# EAGLE design Geiger_v3 (EAGLE 9.6.2)
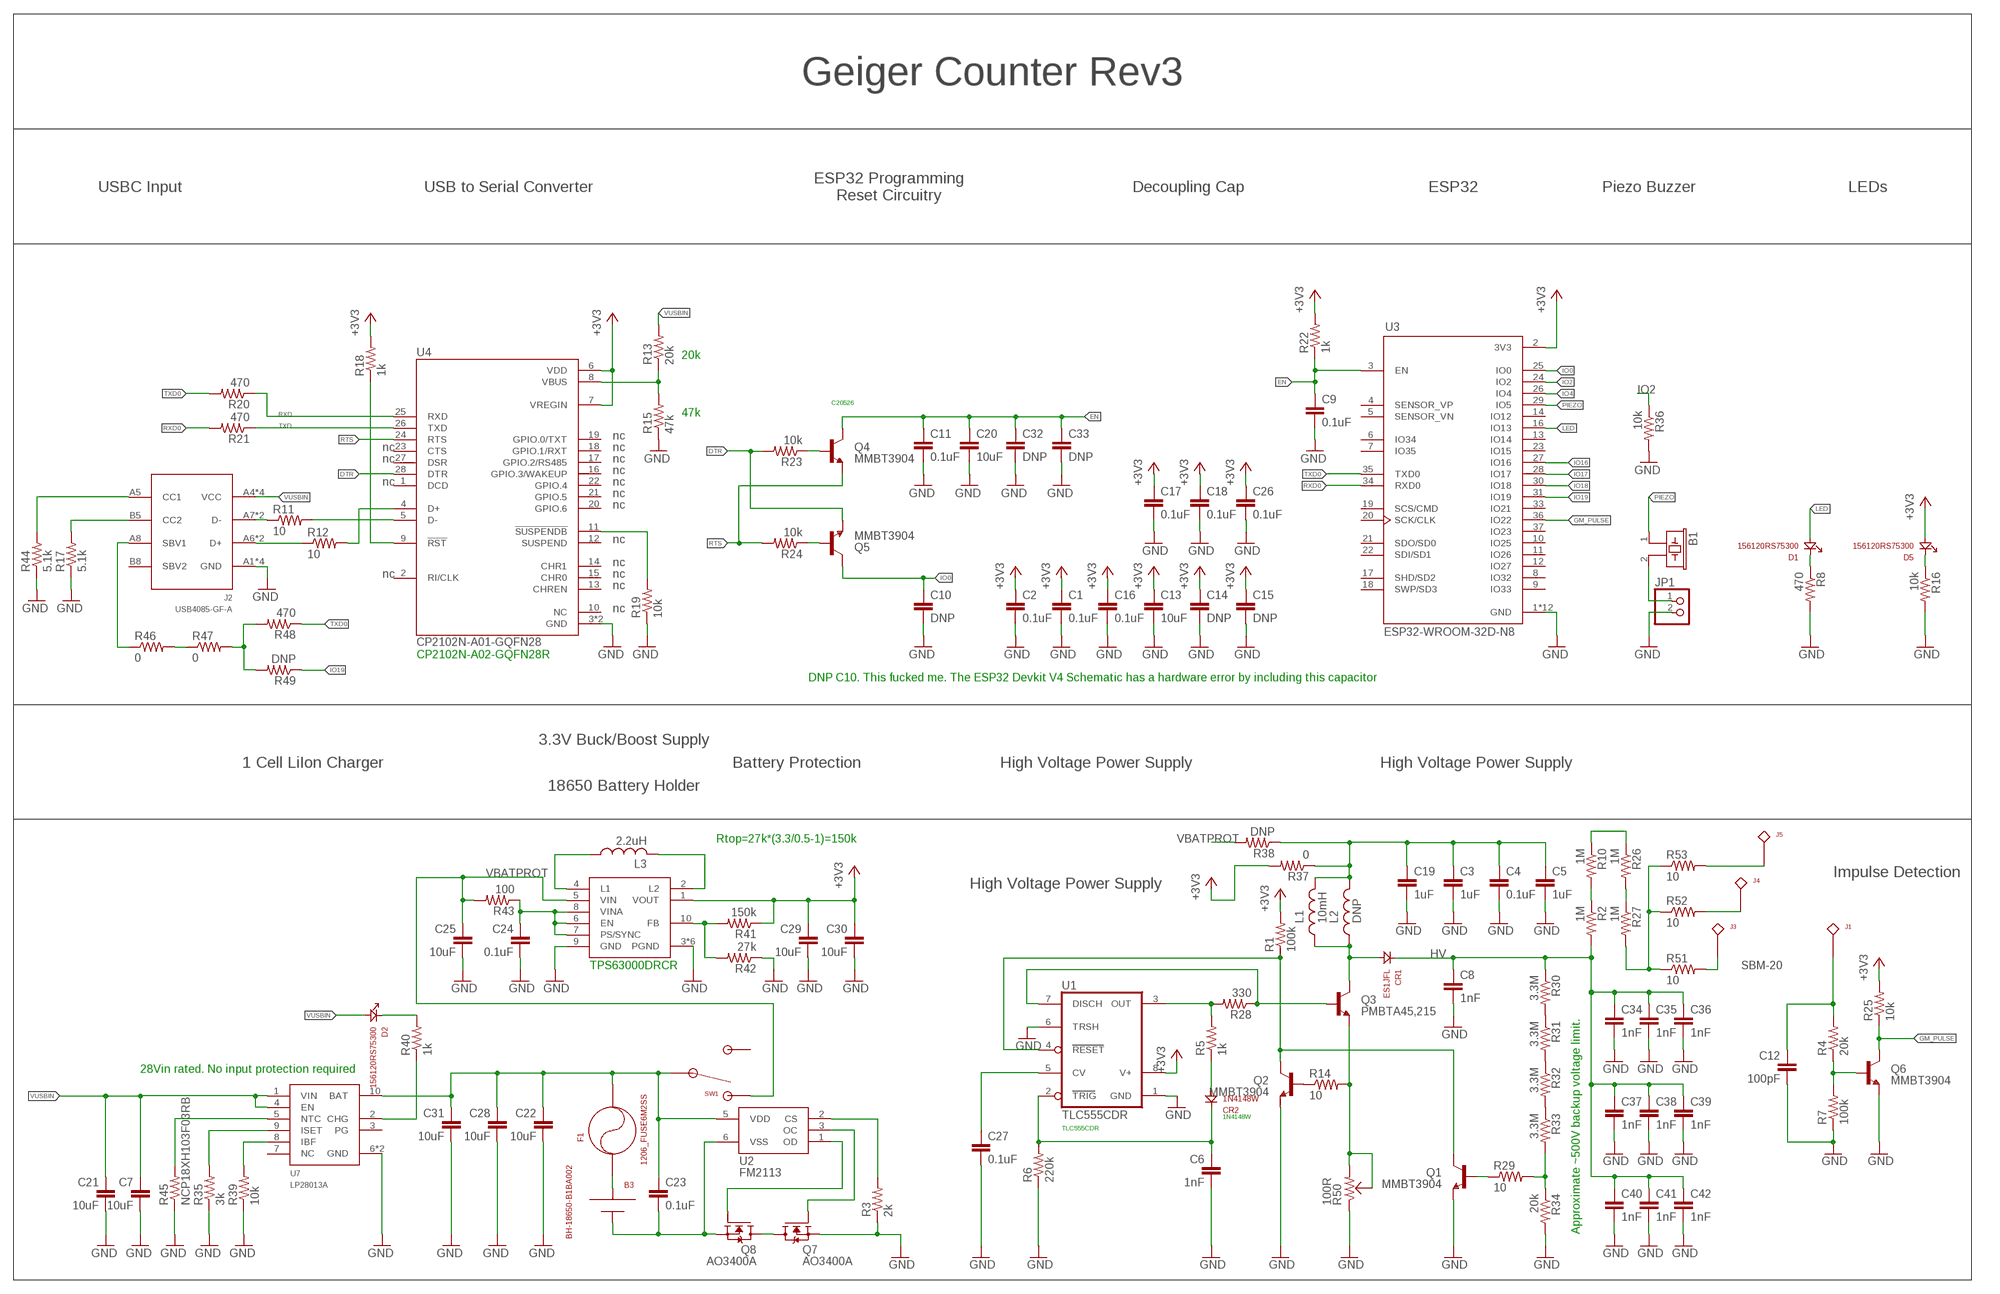
[diagram p0: schematic, sheet 1]

## Parts
B1  PIEZO17MM  [PS1740P02E]
B3  BH-18650-B1BA002  [18650]
C1  0.1uF  0603_CAPACITOR  [0603]
C2  0.1uF  0603_CAPACITOR  [0603]
C3  1uF  0603_CAPACITOR  [0603]
C4  0.1uF  0603_CAPACITOR  [0603]
C5  1uF  0603_CAPACITOR  [0603]
C6  1nF  0603_CAPACITOR  [0603]
C7  10uF  0603_CAPACITOR  [0603]
C8  1nF  1206_CAPACITOR  [1206]
C9  0.1uF  0603_CAPACITOR  [0603]
C10  DNP  0603_CAPACITOR  [0603]
C11  0.1uF  0603_CAPACITOR  [0603]
C12  100pF  0603_CAPACITOR  [0603]
C13  10uF  0603_CAPACITOR  [0603]
C14  DNP  0603_CAPACITOR  [0603]
C15  DNP  0603_CAPACITOR  [0603]
C16  0.1uF  0603_CAPACITOR  [0603]
C17  0.1uF  0603_CAPACITOR  [0603]
C18  0.1uF  0603_CAPACITOR  [0603]
C19  1uF  0603_CAPACITOR  [0603]
C20  10uF  0603_CAPACITOR  [0603]
C21  10uF  0603_CAPACITOR  [0603]
C22  10uF  0603_CAPACITOR  [0603]
C23  0.1uF  0603_CAPACITOR  [0603]
C24  0.1uF  0603_CAPACITOR  [0603]
C25  10uF  0603_CAPACITOR  [0603]
C26  0.1uF  0603_CAPACITOR  [0603]
C27  0.1uF  0603_CAPACITOR  [0603]
C28  10uF  0603_CAPACITOR  [0603]
C29  10uF  0603_CAPACITOR  [0603]
C30  10uF  0603_CAPACITOR  [0603]
C31  10uF  0603_CAPACITOR  [0603]
C32  DNP  0603_CAPACITOR  [0603]
C33  DNP  0603_CAPACITOR  [0603]
C34  1nF  1206_CAPACITOR  [1206]
C35  1nF  1206_CAPACITOR  [1206]
C36  1nF  1206_CAPACITOR  [1206]
C37  1nF  1206_CAPACITOR  [1206]
C38  1nF  1206_CAPACITOR  [1206]
C39  1nF  1206_CAPACITOR  [1206]
C40  1nF  1206_CAPACITOR  [1206]
C41  1nF  1206_CAPACITOR  [1206]
C42  1nF  1206_CAPACITOR  [1206]
CR1  ES1JFL  [SOD123(AK)]
CR2  1N4148W  BAS21GWX  [SOD123]
D1  156120RS75300  [1206_REV]
D2  156120RS75300  [1206_REV]
D5  156120RS75300  [1206_REV]
F1  1206_FUSE6M2SS  [1206_FUSE_6M2_SS]
J1  01010002Z  [01010002Z]
J2  USB4085-GF-A  [USBC]
J3  01010002Z  [01010002Z]
J4  01010002Z  [01010002Z]
J5  01010002Z  [01010002Z]
JP1  PINHD-1X2  [1X02]
L1  10mH  FNR8065S103MT  [FNR8065S]
L2  DNP  SDR1005-103KL  [SDR1005]
L3  2.2uH  CY43-2.2UH  [CY43]
Q1  MMBT3904  MMBT3904-TPCENTERED  [SOT23-3_CENTERED]
Q2  MMBT3904  MMBT3904-TPCENTERED  [SOT23-3_CENTERED]
Q3  PMBTA45,215  [SOT23-3]
Q4  MMBT3904  MMBT3904-TPCENTERED  [SOT23-3_CENTERED]
Q5  MMBT3904  MMBT3904-TPCENTERED  [SOT23-3_CENTERED]
Q6  MMBT3904  MMBT3904-TPCENTERED  [SOT23-3_CENTERED]
Q7  AO3400A  [SOT23-3_CENTERED]
Q8  AO3400A  [SOT23-3_CENTERED]
R1  100k  0603_RESISTOR  [0603]
R2  1M  0603_RESISTOR  [0603]
R3  2k  0603_RESISTOR  [0603]
R4  20k  0603_RESISTOR  [0603]
R5  1k  0603_RESISTOR  [0603]
R6  220k  0603_RESISTOR  [0603]
R7  100k  0603_RESISTOR  [0603]
R8  470  0603_RESISTOR  [0603]
R10  1M  0603_RESISTOR  [0603]
R11  10  0603_RESISTOR  [0603]
R12  10  0603_RESISTOR  [0603]
R13  20k  0603_RESISTOR  [0603]
R14  10  0603_RESISTOR  [0603]
R15  47k  0603_RESISTOR  [0603]
R16  10k  0603_RESISTOR  [0603]
R17  5.1k  0603_RESISTOR  [0603]
R18  1k  0603_RESISTOR  [0603]
R19  10k  0603_RESISTOR  [0603]
R20  470  0603_RESISTOR  [0603]
R21  470  0603_RESISTOR  [0603]
R22  1k  0603_RESISTOR  [0603]
R23  10k  0603_RESISTOR  [0603]
R24  10k  0603_RESISTOR  [0603]
R25  10k  0603_RESISTOR  [0603]
R26  1M  0603_RESISTOR  [0603]
R27  1M  0603_RESISTOR  [0603]
R28  330  0603_RESISTOR  [0603]
R29  10  0603_RESISTOR  [0603]
R30  3.3M  0603_RESISTOR  [0603]
R31  3.3M  0603_RESISTOR  [0603]
R32  3.3M  0603_RESISTOR  [0603]
R33  3.3M  0603_RESISTOR  [0603]
R34  20k  0603_RESISTOR  [0603]
R35  3k  0603_RESISTOR  [0603]
R36  10k  0603_RESISTOR  [0603]
R37  0  0603_RESISTOR  [0603]
R38  DNP  0603_RESISTOR  [0603]
R39  10k  0603_RESISTOR  [0603]
R40  1k  0603_RESISTOR  [0603]
R41  150k  0603_RESISTOR  [0603]
R42  27k  0603_RESISTOR  [0603]
R43  100  0603_RESISTOR  [0603]
R44  5.1k  0603_RESISTOR  [0603]
R45  NCP18XH103F03RB  0603_RESISTOR  [0603]
R46  0  1206_RESISTOR  [1206]
R47  0  1206_RESISTOR  [1206]
R48  470  0603_RESISTOR  [0603]
R49  DNP  0603_RESISTOR  [0603]
R50  100R  ST-4ETB101  [ST-4]
R51  10  0603_RESISTOR  [0603]
R52  10  0603_RESISTOR  [0603]
R53  10  0603_RESISTOR  [0603]
SW1  SPDT  100SP1T2B4M6QE  [TOGGLE_RA]
U1  TLC555CDR  TLC555CDG4  [SOIC8]
U2  FM2113  [SOT23-6]
U3  ESP32-WROOM-32D-N8  ESP32-WROOM-32D  [MODULE_ESP32-WROOM-32D]
U4  CP2102N-A01-GQFN28  [QFN50P500X500X80-29N]
U6  TPS63000DRCR  [S-PVSON-N10]
U7  LP28013A  [10DFN]

## Nets
+3V3: C1.1 C2.1 C13.1 C14.1 C15.1 C16.1 C17.1 C18.1 C26.1 C29.1 C30.1 D5.A R1.2 R18.2 R22.2 R25.2 R37.2 R41.1 U1.8(V+) U3.2(3V3) U4.6(VDD) U4.7(VREGIN) U6.1(VOUT)
DTR: Q5.2(E) R23.2 U4.28(DTR)
EN: C9.1 C11.1 C20.1 C32.1 C33.1 Q4.3(C) R22.1 U3.3(EN)
GM_PULSE: Q6.3(C) R25.1 U3.36(IO22)
GND: C1.2 C2.2 C3.2 C4.2 C5.2 C6.2 C7.2 C8.2 C9.2 C10.2 C11.2 C12.2 C13.2 C14.2 C15.2 C16.2 C17.2 C18.2 C19.2 C20.2 C21.2 C22.2 C24.2 C25.2 C26.2 C27.2 C28.2 C29.2 C30.2 C31.2 C32.2 C33.2 C34.2 C35.2 C36.2 C37.2 C38.2 C39.2 C40.2 C41.2 C42.2 J2.A1(GND) J2.A12(GND) J2.B1(GND) J2.B12(GND) JP1.2 Q1.2(E) Q2.2(E) Q6.2(E) Q7.2(S) R3.1 R6.1 R7.1 R8.2 R15.1 R16.2 R17.1 R19.1 R34.2 R35.1 R36.2 R39.1 R42.1 R44.1 R45.1 R50.3 U1.1(GND) U1.6(TRSH) U3.1(GND) U3.15(GND) U3.38(GND) U3.39_1(GND) U3.39_2(GND) U3.39_3(GND) U3.39_4(GND) U3.39_5(GND) U3.39_6(GND) U3.39_7(GND) U3.39_8(GND) U3.39_9(GND) U4.3(GND) U4.29(GND) U6.3(PGND) U6.9(GND) U6.PG1(PGND) U6.PG2(PGND) U6.PG3(PGND) U6.PG4(PGND) U6.PG(PGND) U7.6(GND) U7.GF(GND)
HV [HV]: C8.1 C34.1 C35.1 C36.1 C37.1 C38.1 C39.1 C40.1 C41.1 C42.1 CR1.K R2.2 R30.1
IO0: C10.1 Q5.3(C) U3.25(IO0)
IO2: R36.1 U3.24(IO2)
IO4: U3.26(IO4)
IO16: U3.27(IO16)
IO17: U3.28(IO17)
IO18: U3.30(IO18)
IO19: R49.1 U3.31(IO19)
LED: D1.A U3.16(IO13)
N$1: CR2.2(A) R5.1
N$2: J2.A7(D-) J2.B7(D-) R11.1
N$3: Q1.3(C) Q2.3(C) R1.1 U1.4(RESET)
N$4: J2.A6(D+) J2.B6(D+) R12.1
N$5: R11.2 U4.5(D-)
N$6: R12.2 U4.4(D+)
N$7: R13.1 R15.2 U4.8(VBUS)
N$8: Q3.1(B) R28.1 U1.7(DISCH)
N$9: C6.1 CR2.1(K) R6.2 U1.2(TRIG)
N$10: R5.2 R28.2 U1.3(OUT)
N$11: Q3.2(E) R14.2 R50.1 R50.2(ADJ)
N$12: B1.2 JP1.1
N$13: Q2.1(B) R14.1
N$14: Q6.1(B) R4.1 R7.2
N$15 [HV]: J4.P$1 R52.2
N$16 [HV]: R2.1 R10.2
N$17 [HV]: R10.1 R26.1
N$18: R18.1 U4.9(!RST)
N$19: D5.K R16.1
N$20: R19.2 U4.11(!SUSPENDB)
N$21 [HV]: R26.2 R27.1
N$22: Q4.1(B) R23.1
N$23: R39.2 U7.8(IBF)
N$24: Q5.1(B) R24.1
N$25: J2.B5(CC2) R17.2
N$26: Q1.1(B) R29.1
N$27: D1.K R8.1
N$28 [HV]: R31.2 R32.1
N$29: R29.2 R33.2 R34.1
N$30 [HV]: R30.2 R31.1
N$31 [HV]: R32.2 R33.1
N$32: J2.A5(CC1) R44.2
N$33: C27.1 U1.5(CV)
N$34: R40.1 U7.2(CHG)
N$35: C3.1 C4.1 C5.1 C19.1 L1.P$2 L2.P$2 R37.1 R38.1
N$36: R35.2 U7.9(ISET)
N$37: D2.K R40.2
N$38: R45.2 U7.5(NTC)
N$39: C12.1 J1.P$1 R4.2
N$40: B3.- C23.2 Q8.2(S) U2.6(VSS)
N$41: C22.1 C23.1 C28.1 C31.1 F1.P$2 SW1.2(COM) U2.5(VDD) U7.10(BAT)
N$42: Q8.1(G) U2.1(OD)
N$43: Q7.3(D) Q8.3(D)
N$44: L3.P$1 U6.4(L1)
N$45: Q7.1(G) U2.3(OC)
N$46: R3.2 U2.2(CS)
N$47: L3.P$2 U6.2(L2)
N$48: R41.2 R42.2 U6.10(FB)
N$49: C24.1 R43.1 U6.6(EN) U6.7(PS/SYNC) U6.8(VINA)
N$50: J2.A8(SBV1) R46.1
N$51: R46.2 R47.1
N$52: R47.2 R48.2 R49.2
N$53 [HV]: J5.P$1 R53.2
N$54 [HV]: R27.2 R51.1 R52.1 R53.1
N$55 [HV]: J3.P$1 R51.2
PIEZO: B1.1 U3.29(IO5)
RAWBATT [HV]: B3.+ F1.P$1
RTS: Q4.2(E) R24.2 U4.24(RTS)
RXD: R20.1 U4.25(RXD)
RXD0: R21.2 U3.34(RXD0)
SW [HV]: CR1.A L1.P$1 L2.P$1 Q3.3(C)
TXD: R21.1 U4.26(TXD)
TXD0: R20.2 R48.1 U3.35(TXD0)
VBATPROT: C25.1 R38.2 R43.2 SW1.3 U6.5(VIN)
VUSBIN: C7.1 C21.1 D2.A J2.A4(VCC) J2.A9(VCC) J2.B4(VCC) J2.B9(VCC) R13.2 U7.1(VIN) U7.4(EN)
Unconnected: J2.B8(SBV2) SW1.1 U3.4(SENSOR_VP) U3.5(SENSOR_VN) U3.6(IO34) U3.7(IO35) U3.8(IO32) U3.9(IO33) U3.10(IO25) U3.11(IO26) U3.12(IO27) U3.13(IO14) U3.14(IO12) U3.17(SHD/SD2) U3.18(SWP/SD3) U3.19(SCS/CMD) U3.20(SCK/CLK) U3.21(SDO/SD0) U3.22(SDI/SD1) U3.23(IO15) U3.33(IO21) U3.37(IO23) U4.1(DCD) U4.2(RI/CLK) U4.10(NC) U4.12(SUSPEND) U4.13(CHREN) U4.14(CHR1) U4.15(CHR0) U4.16(GPIO.3/WAKEUP) U4.17(GPIO.2/RS485) U4.18(GPIO.1/RXT) U4.19(GPIO.0/TXT) U4.20(GPIO.6) U4.21(GPIO.5) U4.22(GPIO.4) U4.23(CTS) U4.27(DSR) U7.3(PG) U7.7(NC)

## Notes on the sheet
- Geiger Counter Rev3
- USBC Input | USB to Serial Converter
- ESP32 Programming
  Reset Circuitry
- Decoupling Cap | ESP32 | Piezo Buzzer | LEDs
- 20k
- C20526
- 47k
- nc
- nc | nc
- nc | nc
- nc
- nc | nc
- nc
- nc
- nc
- nc
- nc | nc
- nc
- nc
- CP2102N-A02-GQFN28R
- DNP C10. This fucked me. The ESP32 Devkit V4 Schematic has a hardware error by including this capacitor
- 3.3V Buck/Boost Supply
- 1 Cell LiIon Charger | Battery Protection | High Voltage Power Supply | High Voltage Power Supply
- 18650 Battery Holder
- Rtop=27k*(3.3/0.5-1)=150k
- Impulse Detection
- High Voltage Power Supply
- TPS63000DRCR | SBM-20
- 28Vin rated. No input protection required
- 1N4148W
- TLC555CDR
- Approximate ~500V backup voltage limit.

## Library data of the parts
B1 = mightyohm:PIEZO; OC_FARNELL: unknown; OC_NEWARK: unknown
B3 = ruark2:BH-18650-B1BA002: 18650 JLCPCB C2988620
C1-C7 C9-C33 = ruark2:0603_CAPACITOR: 0603 Capacitor -- WARNING: NO DEFINED VALUE OR PART NUMBER; VALUE: sel
C8 C34-C42 = ruark2a:1206_CAPACITOR: NO DEFINED PN; VALUE: sel
CR1 = ruark2:ES1JFL: Diode Standard 600 V 1A Surface Mount SOD-123F; PARTNO: ES1JFLCT-ND
CR2 = ruark2:BAS21GWX: Diode Standard 200V 225mA (DC) Surface Mount SOD-123; PARTNO: 1727-7323-1-ND
D1 D2 D5 = ruark2:156120RS75300: Red 624nm LED Indication - Discrete 2V 1206 Reverse Mount (3216 Metric); PARTNO: 732-5031-1-ND
F1 = ruark2:1206_FUSE
J1 J3-J5 = ruark2:01010002Z: SMD Fuse Clip 15 A 250V 1 Circuit Cartridge Chassis Mount; PARTNO: F4080-ND
J2 = ruark2a:USB4085-GF-A: USB - C USB 2.0 Receptacle Connector 16 Position Through Hole, Right Angle; PARTNO: 2073-USB4085-GF-ACT-ND
JP1 = pinhead:PINHD-1X2: PIN HEADER
L1 = ruark2:FNR8065S103MT: 130mA 10mH ±20% 22.8Ω SMD Power Inductors ROHS
L2 = ruark2:SDR1005-103KL: 10 mH Unshielded Wirewound Inductor 100 mA 39Ohm Max Nonstandard 100mA; PARTNO: SDR1005-103KLCT-ND; VALUE: 10mH
L3 = ruark2a:CY43-2.2UH: 2.3A 2.2uH ±20% 42mΩ SMD,4x4.5mm Inductors (SMD) ROHS; JLCPCB: C2929416
Q1 Q2 Q4-Q6 = ruark2a:MMBT3904-TP: Bipolar (BJT) Transistor NPN 40V 200mA 300MHz 350mW Surface Mount SOT-23 (SMD 2N3904)
Q3 = ruark2:PMBTA45,215: Bipolar (BJT) Transistor NPN 500 V 150 mA 35MHz 300 mW Surface Mount TO-236AB; PARTNO: 1727-5332-1-ND
Q7 Q8 = ruark2a:AO3400A: N-Channel 5.7A (Ta) 1.4W (Ta) Surface Mount SOT-23-3L
R1-R8 R10-R45 R48 R49 R51-R53 = ruark2:0603_RESISTOR: 0603 Resistor -- WARNING: NO DEFINED PART NUMBER OR VALUE; VALUE: sel
R46 R47 = ruark2a:1206_RESISTOR: NO DEFINED PN; VALUE: sel
R50 = ruark2:ST-4ETB101: ±20% ±100ppm/℃ 250mW 100Ω SMD Variable Resistors/Potentiometers ROHS; JLCPCB: C2922093
SW1 = ruark2:100SP1T2B4M6QE: Toggle Switch SPDT Through Hole, Right Angle 5A 120V; PARTNO: EG2362-ND
U1 = ruark2:TLC555CDG4: 555 Type, Timer/Oscillator (Single) IC 2.1MHz 8-SOIC; PARTNO: 296-52992-ND
U2 = ruark2a:FM2113: SOT-23-6 Battery Protection UVLO, OV, OC
U3 = ESP32-WROOM-32D:ESP32-WROOM-32D: Bluetooth, WiFi 802.11b/g/n, Bluetooth v4.2 + EDR, Class 1, 2 and 3 Transceiver Module 2.4GHz ~ 2.5GHz Integrated, Trace Surface Mount Check prices <https://pricing.snapeda.com/parts/ESP32-WROOM-32D/Espressif%20Systems/view-part?ref=eda>; AVAILABILITY: Bad; DESCRIPTION: Bluetooth, WiFi 802.11b/g/n, Bluetooth v4.2 +EDR, Class 1, 2 and 3 Transceiver Module 2.4GHz ~ 2.5GHz Integrated, Trace Surface Mount; MF: Espressif Systems; MP: ESP32-WROOM-32D; PACKAGE: Module Espressif Systems; PRICE: None
U4 = CP2102N-A01-GQFN28:CP2102N-A01-GQFN28: USB Bridge, USB to UART USB 2.0 UART Interface 28-QFN (5x5) Check availability <https://pricing.snapeda.com/parts/CP2102N-A01-GQFN28/Silicon%20Labs/view-part?ref=eda>; AVAILABILITY: In Stock; DESCRIPTION: USB Bridge, USB to UART USB 2.0 UART Interface 28-QFN (5x5); MF: Silicon Labs; MP: CP2102N-A01-GQFN28; PACKAGE: WFQFN-28 Silicon Labs; PRICE: None
U6 = ruark2a:TPS63000DRCR: Buck-Boost Switching Regulator IC Positive Adjustable 1.2V 1 Output 1.6A (Switch) 10-VFDFN Exposed Pad; PARTNO: 296-19641-1-ND
U7 = ruark2:LP28013A: TDFN-10 Battery Management ICs ROHS JLCPCB: C517139

## Net classes
1 HV: clearance 1.27 mm

## Board
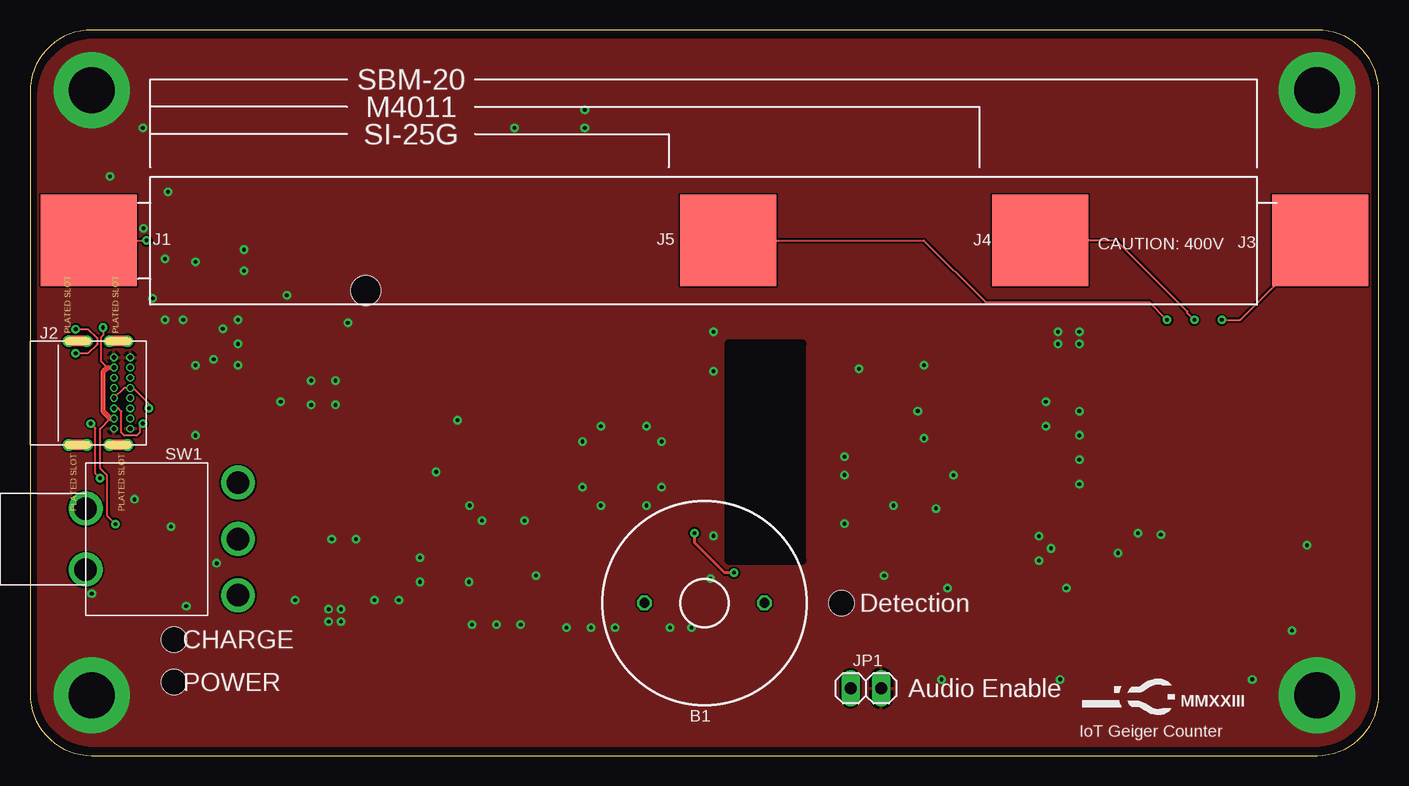
[diagram p1: board, top side]
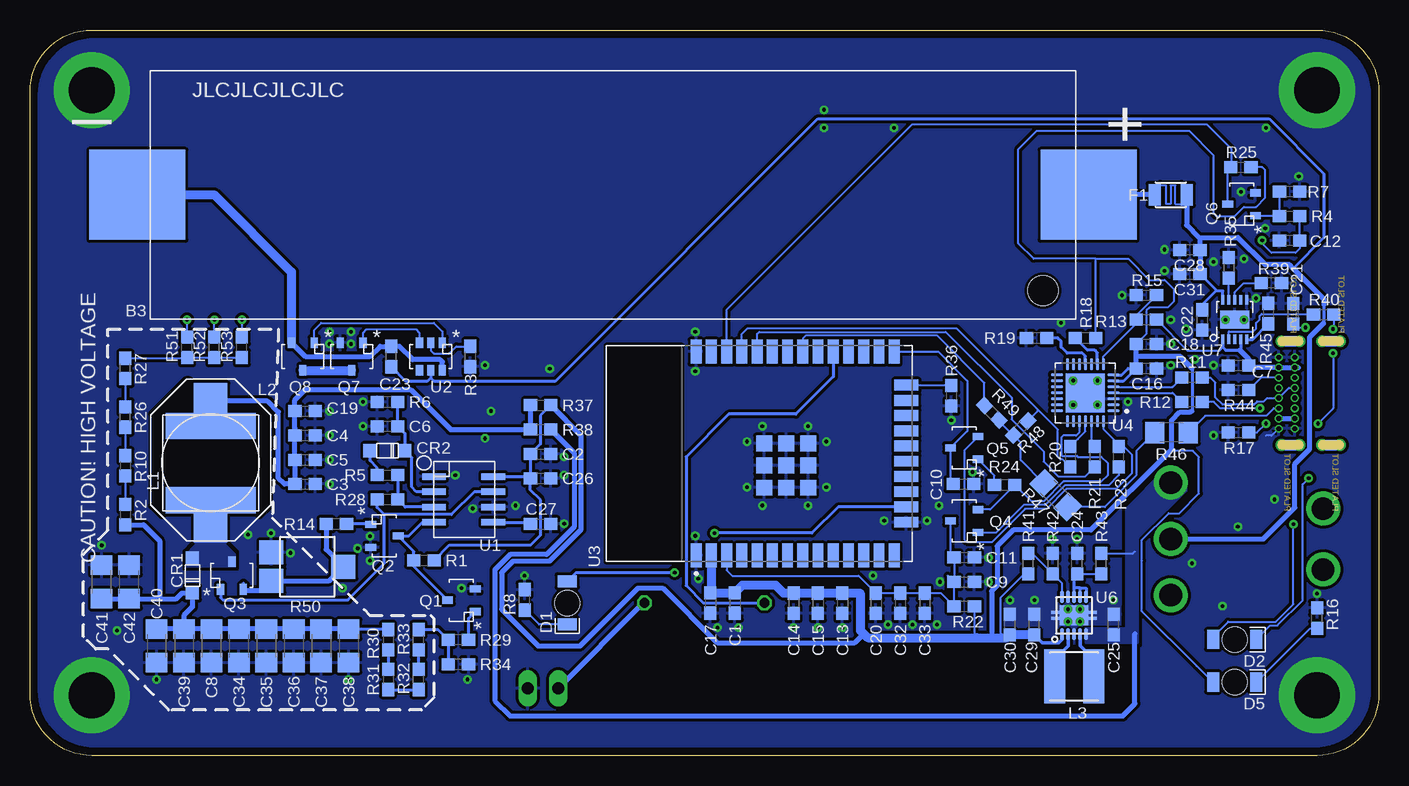
[diagram p2: board, bottom side, seen from below]

Size 112.4 x 60.5 mm. Coordinates in mm from the lower left corner, seen from the top.
Outline: 0,55.35 0,5.15 arc90 5.15,0 107.25,0 arc90 112.4,5.15 112.4,55.35 arc90 107.25,60.5 5.15,60.5 arc90 0,55.35
Copper layers (1*16): Top 0.035mm / dielectric 1.5mm / Bottom 0.035mm
Design rules "default *": minimum track width 6mil, minimum drill 12mil, track to track 6mil, track to pad 6mil, pad to pad 6mil, via to via 6mil, smd to smd 6mil, copper to edge 0mil, drill to drill 6mil, minimum pad ring 5mil, minimum via ring 8mil, stop-mask expansion 4mil, vias tented up to drill 12mil, thermal gap 10mil
tRestrict: area 58.2,16.3 to 64.3,34.3
bRestrict: area 92.5,20.1 to 102.2,31.3; area 22.9,4.3 to 27.9,8.7

### Footprints (pad centres in the part's own frame; a part is rotated, then mirrored left to right if it is on the bottom)
PS1740P02E = drill 0.813 octagon: 1 -5,0; 2 5,0
18650 = smd 8 x 7.5: + 39.63,0; - -39.63,0 | hole 2.5: 35.84,-8
0603 = smd 1.1 x 1: 1 -0.85,0; 2 0.85,0
1206 = smd 1.6 x 1.8: 1 -1.4,0; 2 1.4,0
SOD123(AK) = smd 1.1 x 1.1: A 1.45,0; K -1.45,0
SOD123 = smd 1.1 x 1.1: 1 -1.45,0; 2 1.45,0
1206_REV = smd 1 x 1.6: A -1.8,0; K 1.8,0 | hole 2.1: 0,0
1206_FUSE_6M2_SS = smd 1.016 x 1.778: P$1 -1.333,0; P$2 1.333,0
01010002Z = smd 8.001 x 7.62: P$1 0,0
USBC = drill 0.4 pad 0.65: A1 -2.975,0.98; A4 -2.125,0.98; A5 -1.275,0.98; A6 -0.425,0.98; A7 0.425,0.98; A8 1.275,0.98; A9 2.125,0.98; A12 2.975,0.98; B1 2.975,-0.37; B4 2.125,-0.37; B5 1.275,-0.37; B6 0.425,-0.37; B7 -0.425,-0.37; B8 -1.275,-0.37; B9 -2.125,-0.37; B12 -2.975,-0.37 | drill 0.65 pad 0.9: P$1 -4.325,0.75; P$2 4.325,0.75; P$3 4.325,-0.75; P$4 -4.325,-2.63; P$5 -4.325,-0.75; P$6 -4.325,-4.13; P$7 4.325,-2.63; P$8 4.325,-4.13
1X02 = drill 1.016 long: 1 -1.27,0; 2 1.27,0
FNR8065S = smd 2.2 x 7.5: P$1 -3.1,0; P$2 3.1,0
SDR1005 = smd 3 x 2.8: P$1 -5.15,0; P$2 5.15,0
CY43 = smd 1.75 x 4.5: P$1 1.625,0; P$2 -1.625,0
SOT23-3_CENTERED = smd 0.6 x 0.9: 1 -0.95,-1.15; 2 0.95,-1.15; 3 0,1.15
SOT23-3 = smd 0.6 x 0.9: 1 0.32,-1.15; 2 2.22,-1.15; 3 1.27,1.15
ST-4 = smd 2 x 2: 1 1.175,-3; 2 0,3; 3 -1.175,-3
TOGGLE_RA = drill 1.88: 1 4.699,12.7; 2 0,12.7; 3 -4.699,12.7; P$4 -2.54,0; P$5 2.54,0
SOIC8 = smd 1.981 x 0.533: 1 -2.477,1.905; 2 -2.477,0.635; 3 -2.477,-0.635; 4 -2.477,-1.905; 5 2.477,-1.905; 6 2.477,-0.635; 7 2.477,0.635; 8 2.477,1.905
SOT23-6 = smd 0.6 x 0.9: 1 -0.95,-1.15; 2 0,-1.15; 3 0.95,-1.15; 4 0.95,1.15; 5 0,1.15; 6 -0.95,1.15
MODULE_ESP32-WROOM-32D = smd 2 x 0.9: 1 -8.5,5.26; 2 -8.5,3.99; 3 -8.5,2.72; 4 -8.5,1.45; 5 -8.5,0.18; 6 -8.5,-1.09; 7 -8.5,-2.36; 8 -8.5,-3.63; 9 -8.5,-4.9; 10 -8.5,-6.17; 11 -8.5,-7.44; 12 -8.5,-8.71; 13 -8.5,-9.98; 14 -8.5,-11.25; 25 8.5,-11.25; 26 8.5,-9.98; 27 8.5,-8.71; 28 8.5,-7.44; 29 8.5,-6.17; 30 8.5,-4.9; 31 8.5,-3.63; 32 8.5,-2.36; 33 8.5,-1.09; 34 8.5,0.18; 35 8.5,1.45; 36 8.5,2.72; 37 8.5,3.99; 38 8.5,5.26 | smd 0.9 x 2: 15 -5.715,-12.25; 16 -4.445,-12.25; 17 -3.175,-12.25; 18 -1.905,-12.25; 19 -0.635,-12.25; 20 0.635,-12.25; 21 1.905,-12.25; 22 3.175,-12.25; 23 4.445,-12.25; 24 5.715,-12.25 | smd 1.33 x 1.33: 39_1 -2.835,-0.405; 39_2 -1,-0.405; 39_3 0.835,-0.405; 39_4 -2.835,-2.24; 39_5 -1,-2.24; 39_6 0.835,-2.24; 39_7 -2.835,-4.075; 39_8 -1,-4.075; 39_9 0.835,-4.075
QFN50P500X500X80-29N = smd 1.01 x 0.27: 1 -2.36,1.5; 2 -2.36,1; 3 -2.36,0.5; 4 -2.36,0; 5 -2.36,-0.5; 6 -2.36,-1; 7 -2.36,-1.5; 15 2.36,-1.5; 16 2.36,-1; 17 2.36,-0.5; 18 2.36,0; 19 2.36,0.5; 20 2.36,1; 21 2.36,1.5 | smd 0.27 x 1.01: 8 -1.5,-2.36; 9 -1,-2.36; 10 -0.5,-2.36; 11 0,-2.36; 12 0.5,-2.36; 13 1,-2.36; 14 1.5,-2.36; 22 1.5,2.36; 23 1,2.36; 24 0.5,2.36; 25 0,2.36; 26 -0.5,2.36; 27 -1,2.36; 28 -1.5,2.36 | smd 3.25 x 3.25: 29 0,0
S-PVSON-N10 = smd 0.28 x 1: 1 -1,-1.55; 2 -0.5,-1.55; 3 0,-1.55; 4 0.5,-1.55; 5 1,-1.55; 6 1,1.55; 7 0.5,1.55; 8 0,1.55; 9 -0.5,1.55; 10 -1,1.55 | smd 2.4 x 1.65: PG 0,0 | smd 0.7 x 0.28: PG1 -1.55,0.25; PG2 -1.55,-0.25; PG3 1.55,-0.25; PG4 1.55,0.25
10DFN = smd 0.8 x 0.24: 1 -1.65,1; 2 -1.65,0.5; 3 -1.65,0; 4 -1.65,-0.5; 5 -1.65,-1; 6 1.65,-1; 7 1.65,-0.5; 8 1.65,0; 9 1.65,0.5; 10 1.65,1 | smd 1.5 x 2.4: GF 0,0

### Placement (x,y rotation side)
B1  56.2,12.72 0 top
B3  63.82,46.76 0 bottom
C1  53.66,12.72 270 bottom
C2  69.85,25.15 0 bottom
C3  89.47,22.63 0 bottom
C4  89.47,26.69 0 bottom
C5  89.47,24.66 0 bottom
C6  82.62,27.46 180 bottom
C7  11.68,32.51 180 bottom
C8  97.28,9.14 270 bottom
C9  34.54,14.48 0 bottom
C10  34.61,22.63 0 bottom
C11  34.54,16.51 0 bottom
C12  7.43,42.95 180 bottom
C13  44.7,12.7 270 bottom
C14  48.77,12.7 270 bottom
C15  46.74,12.7 270 bottom
C16  19.37,32.28 0 bottom
C17  55.69,12.72 270 bottom
C18  19.37,34.31 0 bottom
C19  89.47,28.73 0 bottom
C20  41.91,12.7 270 bottom
C21  7.11,36.83 90 bottom
C22  14.73,36.32 270 bottom
C23  82.3,33.27 90 bottom
C24  25.15,16 90 bottom
C25  22.1,10.92 90 bottom
C26  69.85,23.11 0 bottom
C27  69.85,19.3 0 bottom
C28  15.75,42.16 180 bottom
C29  28.7,10.92 90 bottom
C30  30.73,10.92 90 bottom
C31  15.75,40.13 180 bottom
C32  39.88,12.7 270 bottom
C33  37.85,12.7 270 bottom
C34  95,9.14 270 bottom
C35  92.71,9.14 270 bottom
C36  90.42,9.14 270 bottom
C37  88.14,9.14 270 bottom
C38  85.85,9.14 270 bottom
C39  99.57,9.14 270 bottom
C40  101.85,9.14 270 bottom
C41  106.43,14.48 90 bottom
C42  104.14,14.48 90 bottom
CR1  98.87,15.01 90 bottom
CR2  82.62,25.42 180 bottom
D1  67.63,12.72 270 bottom
D2  12,9.68 0 bottom
D5  12,6.12 0 bottom
F1  17.34,46.76 0 bottom
J1  4.89,42.95 0 top
J2  7.37,30.23 270 top
J3  107.51,42.95 0 top
J4  84.2,42.95 180 top
J5  58.2,42.95 0 top
JP1  69.66,5.61 0 top
L1  97.35,24.38 90 bottom
L2  97.35,24.41 90 bottom
L3  25.4,6.6 0 bottom
Q1  76.45,12.95 90 bottom
Q2  82.86,18.31 270 bottom
Q3  96.84,15.01 0 bottom
Q4  34.54,19.56 90 bottom
Q5  34.54,25.65 90 bottom
Q6  11.43,45.97 90 bottom
Q7  85.6,33.27 180 bottom
Q8  89.66,33.27 180 bottom
R1  79.57,16.28 0 bottom
R2  104.46,20.09 270 bottom
R3  75.69,33.27 90 bottom
R4  7.43,44.98 0 bottom
R5  82.62,23.39 0 bottom
R6  82.62,29.49 0 bottom
R7  7.43,47.01 180 bottom
R8  71.19,12.98 90 bottom
R10  104.46,24.15 270 bottom
R11  15.56,31.52 180 bottom
R12  15.56,29.49 180 bottom
R13  19.37,36.35 0 bottom
R14  86.87,19.3 180 bottom
R15  19.37,38.38 0 bottom
R16  5.15,11.45 90 bottom
R17  11.68,26.92 0 bottom
R18  24.45,34.82 0 bottom
R19  28.51,34.82 0 bottom
R20  25.72,24.92 270 bottom
R21  23.69,24.92 270 bottom
R22  34.54,12.45 0 bottom
R23  21.66,24.92 90 bottom
R24  31.18,22.58 0 bottom
R25  11.5,49.05 0 bottom
R26  104.46,28.22 90 bottom
R27  104.46,32.28 90 bottom
R28  82.62,21.36 0 bottom
R29  76.71,9.65 180 bottom
R30  82.55,9.65 270 bottom
R31  82.55,6.35 270 bottom
R32  80.01,6.35 90 bottom
R33  80.01,9.65 90 bottom
R34  76.71,7.62 0 bottom
R35  12.51,40.66 270 bottom
R36  35.63,30 270 bottom
R37  69.85,29.21 0 bottom
R38  69.85,27.18 0 bottom
R39  8.96,39.39 180 bottom
R40  4.6,36.76 0 bottom
R41  29.21,16 90 bottom
R42  27.18,16 270 bottom
R43  23.11,16 90 bottom
R44  11.68,30.48 0 bottom
R45  9.21,36.85 270 bottom
R46  17.27,26.92 180 bottom
R47  26.92,21.72 135 bottom
R48  29.84,27.3 225 bottom
R49  32.26,28.57 315 bottom
R50  89.28,15.75 270 bottom
R51  99.31,34.04 90 bottom
R52  97.03,34.04 90 bottom
R53  94.74,34.04 90 bottom
SW1  4.64,18.06 270 top
U1  76.27,21.36 0 bottom
U2  78.99,33.27 180 bottom
U3  51.63,25.17 90 bottom
U4  24.45,30.25 180 bottom
U6  25.4,11.68 0 bottom
U7  12,36.35 90 bottom

### Tracks (layer width: path | path; a pad name or v marks a point on that pad's centre or on a via)
+3V3
  Bottom 0.152: R25.2 9.72,49.05 9.46,48.79 9.46,46.51 10.23,45.74 11.24,45.74 12,44.98 13.53,44.98 13.78,45.24 13.78,50.06 15.81,52.09 28.51,52.09 30.04,50.57 30.04,42.7 28.77,41.43 23.6,41.43 | R18.2 23.6,41.43 | 23.6,41.43 20.89,41.43 19.12,39.65 17.85,39.65 17.08,38.89 17.08,37.87 17.59,37.36 19.11,37.36 19.37,37.1 19.37,35.16 C18.1 | R22.2 33.69,9.98 33.53,9.82 | 31.5,9.82 31.5,13.21 29.55,15.15 R41.1 | D5.A 15.15,7.47 15.18,7.47 19.75,12.04 19.75,16.26 19.74,16.27 19.74,17.98 17.51,20.2 16.63,20.2 14.99,21.84 14.99,24.89 15.49,25.4 17.39,25.4 17.46,25.33
  Bottom 0.254: U4.6 21.25,31.25 C16.1 20.89,32.28 21.43,31.75 U4.7 | U1.8 70.85,23.27 C26.1 | C26.1 C2.1 69.87,25.98 69.87,28.34 R37.2 | R1.2 77.45,17.55 70.68,17.55 69.85,18.38 69.85,21.29 70.7,22.14 C26.1 | 15.56,32.28 15.56,28.73
  Bottom 0.279: U6.1 26.4,9.67 26.67,9.4 28.03,9.4 C29.1
  Bottom 0.406: C16.1 20.22,33.3 | 20.22,33.3 C18.1 | 20.22,33.3 16.58,33.3 15.56,32.28 | 15.56,28.73 15.62,28.73 15.71,28.63 16.58,28.63 17.27,27.94 17.27,25.52 17.46,25.33 23.99,18.8 30.48,18.8 31.8,17.48 31.8,14.18 32.26,13.73 32.26,9.82 | R37.2 66.5,26.71 66.5,18.82 69.11,16.2 72.16,16.2 73.1,15.26 73.1,12.19 70.05,9.14 66.55,9.14 61.72,13.97 59.69,13.97 55.12,9.4 43.69,9.4 42.93,10.16
  Bottom 0.762: U3.2 55.62,13.65 C17.1 C1.1 53.01,14.22 50.29,14.22 49.62,13.55 C14.1 C15.1 C13.1 43.27,13.55 43.18,13.46 43.18,10.41 42.93,10.16 42.58,9.82 33.53,9.82 32.26,9.82 31.5,9.82 30.99,9.82 C30.1 C29.1
DTR
  Bottom 0.152: U4.28 22.95,27.23 21.66,25.93 R23.2 21.24,25.77 20.59,25.12 20.59,23.52 21.88,22.23 26.04,22.23 27.69,20.57 29.46,20.57 32.26,17.78 34.29,17.78 34.54,18.03 34.54,25.45 Q5.2
EN
  Bottom 0.152: U3.3 54.35,15.44 53.89,14.99 43.35,14.99 C20.1 C32.1 C33.1 36.5,13.55 R22.1 C9.1 | Q4.3 35.69,16.81 C11.1 C9.1 | 35.93,15.01 C9.1
GM_PULSE
  Bottom 0.152: 12.65,48.75 12.58,48.81 | U3.36 54.35,37.18 38.93,52.6 14.29,52.6 12.26,50.57 12.26,49.13 R25.1 12.58,48.81 | Q6.3 12.58,48.81
GND  (via drill 0.3, 3.81 pad 6.35)
  Bottom 0.152: J2.A12 8.93,26.67 9.4,26.67
  Bottom 0.406: U4.29 v25.47,29.23
  other vias: 5.15,55.48 5.15,5.02 107.25,55.48 107.25,5.02 71.95,20.85 67.88,23.39 84.65,27.46 84.65,29.49 87.44,26.69 11.5,47.01 6.67,48.28 9.46,43.97 25.47,31.27 23.43,29.23 23.43,31.27 20.89,29.49 17.34,34.31 17.34,32.54 21.4,38.38 26.48,36.09 75.5,20.6 15.56,16.03 8.7,21.36 13.02,12.47 5.15,13.49 15.31,33.04 67.88,24.92 67.88,19.33 41.21,19.58 36.64,20.85 47.56,20.85 56.71,14.76 56.96,18.31 56.96,32.03 56.96,35.33 46.04,22.38 46.04,26.19 47.56,27.46 51.37,27.46 52.64,26.19 52.64,22.38 51.37,20.85 35.63,27.96 71.19,15.01 87.44,24.66 87.44,22.63 73.98,28.73 74.49,26.44 13.78,41.17 11.24,36.35 11.24,41.43 12.77,36.35 17.34,36.35 87.44,28.73 11.75,19.07 10.23,38.12 16.07,35.58 25.91,11.18 25.91,12.19 24.89,12.19 24.89,11.18 28.7,12.95 30.73,12.95 22.1,12.95 27.18,18.03 25.15,18.03 40.89,10.92 38.86,10.92 32.51,14.48 32.51,16.51 37.66,19.58 92.33,18.54 90.68,16.89 84.07,18.29 85.09,17.27 84.07,16.26 94.23,18.41 86.36,13.97 85.66,35.33 87.44,35.33 87.44,34.31 85.66,34.31 74.49,32.54 40.39,52.32 46.23,52.32 69.09,32.26 46.23,53.85 9.4,52.32 55.12,10.67 53.34,10.67 48.77,10.67 46.74,10.67 44.7,10.67 36.83,10.92 42.16,14.99 36.58,14.48 33.85,23.65 17.85,42.19 17.85,40.41 13.78,26.69 13.78,32.54 76.45,13.97 75.95,6.35 106.43,17.53 101.85,6.35 85.85,6.35 105.16,10.41 76.96,23.37
  pour Top: 0.71,5.4 0.71,55.1 arc-90 5.35,59.74 107.05,59.74 arc-90 111.69,55.1 111.69,5.4 arc-90 107.05,0.76 5.35,0.76 arc-90
  pour Bottom (isolate 0.254, rank 4): 0.71,5.4 0.71,55.1 arc-90 5.35,59.74 107.05,59.74 arc-90 111.69,55.1 111.69,5.4 arc-90 107.05,0.76 5.35,0.76 arc-90
  pour Bottom: 109.84,16.89 109.84,36.04 111.06,36.04 111.06,19.43
  pour Bottom (rank 2, no thermals): 31.5,10.67 21.49,10.67 21.49,12.7 31.5,12.7
HV
  Bottom 0.254: R30.1 85.81,10.5 C38.1
  Bottom 0.406: C38.1 C37.1 C36.1 C35.1 C34.1 C8.1 C39.1 | C39.1 C40.1 | C41.1 C42.1 101.6,13.08 | C39.1 99.57,11.68 98.87,12.38 CR1.K 99.72,13.56 100.21,13.08 101.6,13.08 | R2.2 102.94,19.24 101.6,17.9 101.6,13.08
IO0
  Bottom 0.152: 35.76,22.93 C10.1 35.69,22.86 Q5.3 34.29,27.06 34.29,31.24 36.72,33.67 U3.25
IO2
  Bottom 0.152: U3.24 35.66,30.89 R36.1
IO19
  Bottom 0.152: R49.1 32.86,31.08 36.8,35.02 47.75,35.02 48,34.78 U3.31
LED  (via drill 0.3)
  Top 0.254: v58.67,15.24 57.91,15.24 55.37,17.78 v55.37,18.54
  Bottom 0.254: U3.16 45.06,20.73 47.24,18.54 v55.37,18.54 | v58.67,15.24 66.91,15.24 D1.A
N$1
  Bottom 0.254: R5.1 83.47,23.99 84.07,24.59 CR2.2
N$2
  Bottom 0.152: R11.1 14.04,31.52 13.61,31.09 13.61,29.87 13.01,29.26 10.43,29.26 10.15,29.54 9.58,29.54 9.31,29.8 J2.A7 7.5,30.65 J2.B7
N$3
  Bottom 0.254: 78.87,19.33 U1.4 79.69,19.45 80.84,18.31 Q2.3 80.42,17.02 R1.1 80.42,15.77 Q1.3
N$4  (via drill 0.3)
  Top 0.152: v9.91,28.96 9.91,29.34 8.59,30.65 J2.A6 7.85,30.65 J2.B6
  Bottom 0.152: v9.91,28.96 13.21,28.96 13.74,29.49 R12.1
N$5
  Bottom 0.152: U4.5 17.18,30.75 R11.2
N$6
  Bottom 0.152: U4.4 17.17,30.25 R12.2
N$7
  Bottom 0.152: U4.8 22.95,33.27 20.22,36 R13.1 20.22,36.68 R15.2
N$8
  Bottom 0.254: U1.7 75.38,22 77.28,20.09 82.87,20.09 | R28.1 83.47,20.69 82.87,20.09 | Q3.1 96.52,13.17 96.33,12.98 85.92,12.98 82.87,16.03 82.87,20.09
N$9
  Bottom 0.254: U1.2 80.2,22 80.58,22.38 80.58,24.84 CR2.1 81.17,26.86 C6.1 R6.2
N$10
  Bottom 0.254: U1.3 81.13,20.73 R28.2 R5.2
N$11
  Bottom 0.254: Q3.2 94.62,14.38
  Bottom 0.406: Q3.2 94.53,13.77 92.96,13.77 | 92.96,13.77 92.73,13.77 | 92.96,13.77 92.28,14.46 R50.1 87.46,14.57 R50.2 87.72,17.18 R14.2
N$12
  Bottom 0.406: JP1.1 61.28,12.72 B1.2
N$13
  Bottom 0.254: Q2.1 84.05,19.3 R14.1
N$14
  Bottom 0.152: R7.2 R4.1 | R4.1 8.35,45.05 | Q6.1 8.32,45.02 R4.1
N$15  (via drill 0.3)
  Top 0.152: v97.03,36.32 96.44,36.91 96.44,37.03 90.52,42.95 J4.P$1
  Bottom 0.152: R52.2 v97.03,36.32
N$16
  Bottom 0.152: R10.2 R2.1
N$17
  Bottom 0.152: R26.1 R10.1
N$18
  Bottom 0.254: U4.9 23.45,33.57 23.69,33.81 24.28,33.81 R18.1
N$19
  Bottom 0.152: D5.K 5.72,10.6 R16.1
N$20
  Bottom 0.254: U4.11 24.45,33.3 24.7,33.55 25.97,33.55 26.48,34.06 26.48,34.57 26.74,34.82 R19.2
N$21
  Bottom 0.152: R27.1 R26.2
N$22
  Bottom 0.152: R23.1 21.66,23.39 22.52,22.53 26.16,22.53 27.81,20.88 29.6,20.88 31.87,18.61 Q4.1
N$23
  Bottom 0.152: U7.8 12,38.63 11.24,39.39 R39.2
N$24
  Bottom 0.152: R24.1 32.03,23.34 Q5.1
N$25  (via drill 0.3)
  Top 0.152: v9.4,27.69 9.14,27.43 9.14,26.92 8.89,26.67 7.87,26.67 7.62,26.92 7.62,28.7 7.37,28.95 J2.B5
  Bottom 0.152: R17.2 10.16,26.92 v9.4,27.69
N$26
  Bottom 0.254: R29.1 75.86,11.45 Q1.1
N$27
  Bottom 0.152: D1.K 69.98,10.92 R8.1
N$28
  Bottom 0.254: R31.2 R32.1
N$29
  Bottom 0.254: R33.2 78.41,10.5 R29.2 R34.1
N$30
  Bottom 0.254: R30.2 R31.1
N$31
  Bottom 0.254: R32.2 R33.1
N$32
  Bottom 0.152: J2.A5 9.81,31.5 R44.2
N$33
  Bottom 0.254: U1.5 70.85,19.45 C27.1
N$34
  Bottom 0.152: U7.2 12.5,35.32 12.51,35.33 12.47,35.37 10.44,35.37 10.23,35.58 10.23,36.07 | 10.23,36.07 10.23,36.09 | 10.23,36.07 9.94,36.35 9.94,36.65 9.76,36.83 5.51,36.83 R40.1
N$35
  Bottom 0.152: L1.P$2 L2.P$2
  Bottom 0.406: L2.P$2 92.59,29.56 91.69,28.66 91.69,23.11 91.21,22.63 C3.1 C5.1 C4.1 | 90.32,27.29 C4.1 | C4.1 C19.1 90.32,29.65 89.47,30.5 80.67,30.5 77.35,27.18 R38.1 R37.1
N$36
  Bottom 0.152: U7.9 R35.2
N$37  (via drill 0.3)
  Top 0.152: v5.84,23.11 5.45,23.5 5.45,27.3 v5.06,27.69 | v3.81,35.56 4.83,35.56 5.59,34.8 5.59,34.29 4.83,33.53 v3.81,33.53
  Bottom 0.152: D2.K 9.04,10.84 8.45,10.84 6.35,12.94 6.35,22.61 v5.84,23.11 | R40.2 3.75,35.62 v3.81,35.56 | v3.81,33.53 3.81,28.94 v5.06,27.69
N$38
  Bottom 0.254: U7.5 10.52,34.7 R45.2
N$39  (via drill 0.3)
  Top 0.152: J1.P$1 v9.72,42.95
  Bottom 0.152: R4.2 C12.1 6.58,42.28 6.92,41.93 8.96,41.93 9.72,42.7 v9.72,42.95
N$40
  Bottom 0.406: Q8.2 89.46,33.27 84.07,33.27 83.22,34.12 C23.2 81.62,34.12 80.52,33.02 78.23,33.02 78.04,32.83 U2.6
  Bottom 0.762: B3.- 97.05,46.76 90.61,40.32 Q8.2
N$41
  Bottom 0.254: U7.10 13,38.76 13.56,38.76 | C22.1 14.73,37.59 13.56,38.76 | 13.56,38.76 13.56,38.8 C31.1 | C23.1 81.11,31.24 79.25,31.24 78.99,31.5 | U2.5 78.99,31.5 | 78.99,31.5 78.74,31.24 68.58,31.24 46.74,53.09 9.14,53.09 4.57,48.51 4.57,43.18 7.13,40.62 | 4.57,37.59 4.57,37.38 4.58,37.38 4.58,36.08 4.6,36.06
  Bottom 0.406: F1.P$2 16,44.22 14.99,43.2 | 14.99,43.2 11.75,43.2 9.46,40.92 7.43,40.92 7.13,40.62 4.57,38.06 4.57,37.59 | 14.99,43.2 14.9,43.11 C28.1 C31.1 | SW1.2 9.62,18.06 7,20.68 7,24.33 5.77,25.55 5.77,34.88 4.6,36.06
N$42
  Bottom 0.152: Q8.1 88.71,35.49 88.14,36.07 78.74,36.07 78.04,35.37 U2.1
N$43
  Bottom 0.762: Q8.3 Q7.3
N$44
  Bottom 0.279: U6.4 24.9,9.15 23.77,8.03 L3.P$1
N$45
  Bottom 0.152: Q7.1 84.65,35.24 84.33,35.56 80.26,35.56 79.94,35.24 U2.3
N$46
  Bottom 0.152: U2.2 78.99,33.78 78.74,33.53 77.47,33.53 76.87,34.12 R3.2
N$47
  Bottom 0.279: U6.2 25.9,9.15 27.18,7.87 27.18,6.76 L3.P$2
N$48
  Bottom 0.152: U6.10 26.4,14.37 R42.2 28.88,16.85 R41.2
N$49
  Bottom 0.152: 25.4,14.9 C24.1 R43.1
  Bottom 0.254: U6.8 25.4,13.97 | 25.4,13.97 25.4,14.9 | U6.7 24.89,13.24 24.89,13.97 | 24.89,13.97 25.4,13.97 | 24.89,13.97 24.4,13.97 U6.6
N$50
  Bottom 0.152: J2.A8 8.77,28.95 9.4,28.32 14.47,28.32 R46.1
N$51
  Bottom 0.152: R46.2 20.19,25.4 20.19,23.37 22.83,20.73 R47.1
N$52
  Bottom 0.152: R47.2 29.84,24.64 29.84,26.1 R48.2 31.66,27.91 R49.2
N$53  (via drill 0.3)
  Top 0.152: J5.P$1 74.48,42.95 79.64,37.79 93.27,37.79 v94.74,36.32
  Bottom 0.152: v94.74,36.32 94.74,35.31 94.74,35.08 | 94.74,35.08 95.18,35.08 | R53.2 94.74,35.08
N$54
  Bottom 0.152: R27.2 99.37,33.13 R51.1 R52.1 R53.1
N$55  (via drill 0.3)
  Top 0.152: v99.31,36.32 100.84,36.32 107.19,42.67 107.23,42.67 J3.P$1
  Bottom 0.152: R51.2 v99.31,36.32
PIEZO
  Bottom 0.254: U3.29 45.46,31.59 48.58,28.47 54.17,28.47 57.72,24.92 57.72,14.17 56.28,12.72 B1.1
RAWBATT
  Bottom 0.406: F1.P$1 B3.+
RTS
  Bottom 0.152: U4.24 24.96,26.95 25.21,26.69 25.22,26.69 25.25,26.67 26.32,26.67 26.45,26.54 26.45,25.05 26.38,24.99 25.15,24.99 25.07,24.92 23.11,24.92 22.61,24.41 22.61,23.37 23.14,22.84 26.29,22.84 27.93,21.2 28.94,21.2 R24.2 | R24.2 32.4,20.51 Q4.2 | 30.06,22.84 R24.2
RXD
  Bottom 0.152: R20.1 25.1,26.39 25.09,26.39 24.45,27.02 U4.25
RXD0
  Bottom 0.152: U3.34 51.81,35.15 51.63,35.33 36.09,35.33 30.61,29.84 30.61,28.02 27.94,25.36 27.94,24.51 26.67,23.24 24.51,23.24 R21.2
SW
  Bottom 0.152: L1.P$1 L2.P$1 | L1.P$1 97.65,21.61 97.86,21.61 97.55,21.31 L1.P$1
  pour Bottom (no thermals): 99.38,16.79 99.38,15.77 95.32,15.77 95.32,16.79 96.08,17.55 96.08,20.6 98.62,20.6 98.62,17.55
TXD
  Bottom 0.152: U4.26 23.95,26.03 R21.1
TXD0
  Bottom 0.152: U3.35 53.08,35.15 52.59,35.63 35.21,35.63 28.43,28.85 | R20.2 26.34,24.68 26.51,24.68 26.75,24.93 26.75,27.18 28.43,28.85 | R48.1 28.43,28.72 28.43,28.85
VBATPROT
  Bottom 0.152: R43.2 20.49,16.85 20.32,17.02
  Bottom 0.406: R38.2 67.06,25.23 67.06,19.05 69.34,16.76 72.39,16.76 73.66,15.49 73.66,4.57 72.39,3.3 21.34,3.3 20.32,4.32 20.32,10.16
  pour Bottom (no thermals): 24.46,9.4 20.07,9.4 20.07,18.03 16,22.1 16,23.11 16.76,23.88 17.78,23.88 21.08,20.57 21.08,10.62 24.46,10.62
VUSBIN  (via drill 0.3)
  Top 0.152: v7.11,19.3 6.43,19.99 6.43,23.36 5.84,23.94 5.84,27.25 6.7,28.1 | v6.1,35.69 6.1,35.04 5.9,34.85 5.9,32.89 6.44,32.35
  Top 0.406: J2.B4 6.7,28.1 6.1,28.7 6.1,32 6.44,32.35 J2.B9
  Bottom 0.152: D2.A 13.43,10.05 13.43,10.27 12.55,11.15 8.58,11.15 7.11,12.61 v7.11,19.3 | R13.2 15.96,33.78 13.27,33.78 13,34.04 | C21.1 6.82,35.69 v6.1,35.69
  Bottom 0.254: U7.4 11.5,33.89 11.59,33.81 12.77,33.81 13,34.04 U7.1
  Bottom 0.406: 6.69,32.35 6.7,32.35 J2.B9 J2.A4 10.67,32.35 C7.1 10.83,33.05 11.59,33.81 | J2.A9 J2.B4

### Text on the board
tPlace: SBM-20 | M4011 | SI-25G | CAUTION: 400V | MMXXIII | IoT Geiger Counter
bPlace: CAUTION! HIGH VOLTAGE
tNames: Detection | CHARGE | POWER | Audio Enable
bNames: JLCJLCJLCJLC
tStop: 062